# EAGLE design MTRduino_rev5.0 (EAGLE 7.2.0)
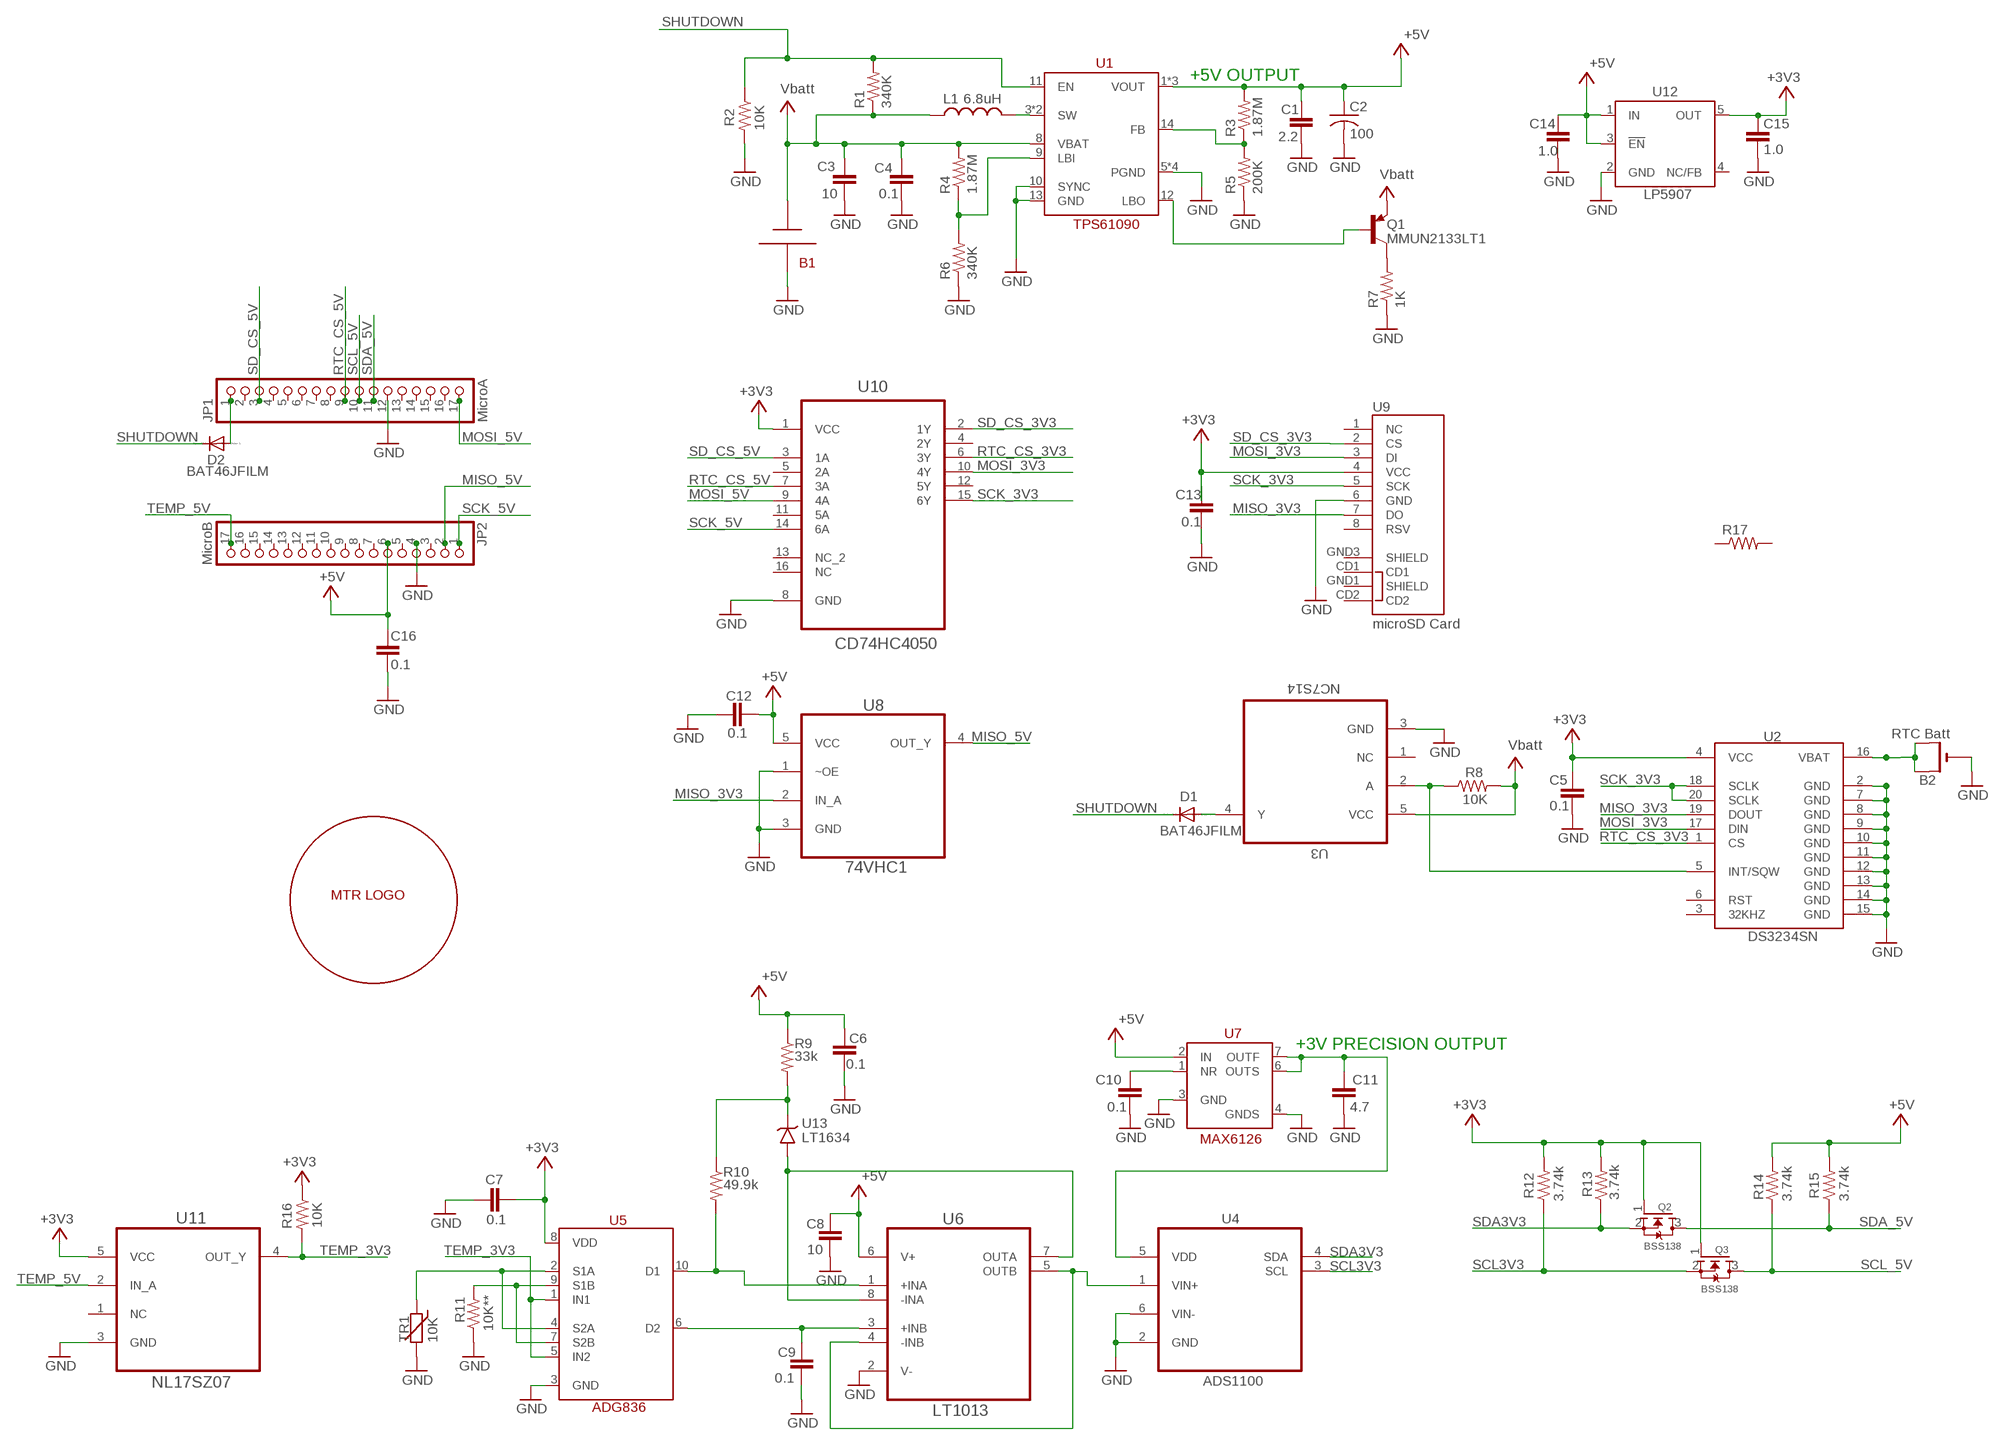
[diagram p0: schematic, sheet 1]

## Parts
B1  2x AA BATT  BATT_AA2  [BATT_AA2]
B2  RTC Batt  CR1220SMT  [CR1220-SMD]
C1  2.2  C-EUC0603  [C0603]
C2  100  C-USC1206K  [C1206K]
C3  10  C-EUC0603  [C0603]
C4  0.1  C-EUC0603  [C0603]
C5  0.1  C-EUC0603  [C0603]
C6  0.1  C-EUC0603  [C0603]
C7  0.1  C-EUC0603  [C0603]
C8  10  C-EUC0603  [C0603]
C9  0.1  C-EUC0603  [C0603]
C10  0.1  C-EUC0603  [C0603]
C11  4.7  C-EUC0603  [C0603]
C12  0.1  C-EUC0603  [C0603]
C13  0.1  C-EUC0603  [C0603]
C14  1.0  C-EUC0603  [C0603]
C15  1.0  C-EUC0603  [C0603]
C16  0.1  C-EUC0603  [C0603]
D1  BAT46JFILM  DIODE-SOD323-R  [SOD323-R]
D2  BAT46JFILM  DIODE-SOD323-R  [SOD323-R]
JP1  MicroA  PINHD-1X17  [1X17]
JP2  MicroB  PINHD-1X17  [1X17]
L1  6.8uH  L-USVLC6045  [VLC6045]
Q1  MMUN2133LT1  MMUN2111LT1  [SC59-BEC]
Q2  BSS138  MOSFET-NREFLOW  [SOT23]
Q3  BSS138  MOSFET-NREFLOW  [SOT23]
R1  340K  R-US_R0603  [R0603]
R2  10K  R-US_R0603  [R0603]
R3  1.87M  R-US_R0805  [R0805]
R4  1.87M  R-US_R0805  [R0805]
R5  200K  R-US_R0603  [R0603]
R6  340K  R-US_R0603  [R0603]
R7  1K  R-US_R0603  [R0603]
R8  10K  R-US_R0603  [R0603]
R9  33k  R-US_R0603  [R0603]
R10  49.9k  R-US_R0603  [R0603]
R11  10K**  R-US_R1206  [R1206]
R12  3.74k  R-US_R0603  [R0603]
R13  3.74k  R-US_R0603  [R0603]
R14  3.74k  R-US_R0603  [R0603]
R15  3.74k  R-US_R0603  [R0603]
R16  10K  R-US_R0603  [R0603]
R17  R-US_R0805  [R0805]
TR1  10K  THERMISTOR_R-5  [R-5]
U1  TPS61090  TPS61090RSAR  [QFN16-4X4]
U2  DS3234SN  DS3234  [DS3234]
U3  NC7S14  1P1G14MDBVREPG4  [SOT95P280X145-5N]
U4  ADS1100  ADS1100A0IDBVT  [SOT95P280X145-6N]
U5  ADG836  [MSOP10]
U6  LT1013  LT1013DS8PBF  [SOIC127P600X175-8N]
U7  MAX6126  [SOIC127P600X175-8N]
U8  74VHC1  M74VHC1GT125DF1G  [SOT65P210X110-5N]
U9  microSD Card  USD-SOCKET  [MICROSD_1:1]
U10  CD74HC4050  M74HC4050RM13TR  [SOIC127P600X175-16N]
U11  NL17SZ07  NL17SZ07DFT2G  [SOT65P210X110-5N]
U12  LP5907  TPS77030  [SOT23-DBV]
U13  LT1634  LT1634BIS8-1.25  [S8]
U$1  MTRLOGO  [MTRLOGO]

## Nets
+3V3: C5.1 C7.2 C13.1 C15.1 Q2.1(G) Q3.1(G) R12.2 R13.2 R16.1 U2.4(VCC) U5.8(VDD) U9.4(VCC) U10.1(VCC) U11.5(VCC) U12.5(OUT)
+5V: C1.1 C2.1 C6.2 C8.2 C12.1 C14.1 C16.1 JP2.6 R3.2 R9.1 R14.2 R15.2 U1.1(VOUT) U1.15(VOUT) U1.16(VOUT) U6.6(V+) U7.2(IN) U8.5(VCC) U12.1(IN) U12.3(!EN)
GND: B1.-(+) B2.- C1.2 C2.2 C3.2 C4.2 C5.2 C6.1 C7.1 C8.1 C9.1 C10.2 C11.2 C12.2 C13.2 C14.2 C15.2 C16.2 JP1.12 JP2.4 R2.2 R5.1 R6.1 R7.1 R11.1 TR1.2 U1.5(PGND) U1.6(PGND) U1.7(PGND) U1.10(SYNC) U1.13(GND) U1.EXP(PGND) U2.2(GND) U2.7(GND) U2.8(GND) U2.9(GND) U2.10(GND) U2.11(GND) U2.12(GND) U2.13(GND) U2.14(GND) U2.15(GND) U3.3(GND) U4.2(GND) U4.6(VIN-) U5.3(GND) U6.2(V-) U7.3(GND) U7.4(GNDS) U8.1(~OE) U8.3(GND) U9.6(GND) U10.8(GND) U11.3(GND) U12.2(GND)
MISO_3V3: U2.19(DOUT) U8.2(IN_A) U9.7(DO)
MISO_5V: JP2.2 U8.4(OUT_Y)
MOSI_3V3: U2.17(DIN) U9.3(DI) U10.10(4Y)
MOSI_5V: JP1.17 U10.9(4A)
N$1: D1.A U3.4(Y)
N$2: C9.2 U5.6(D2) U6.3(+INB)
N$4: C10.1 U7.1(NR)
N$5: U4.1(VIN+) U6.4(-INB) U6.5(OUTB)
N$6: B2.+$1(+) B2.+$2(+1) U2.16(VBAT)
N$7: L1.P$3 U1.3(SW) U1.4(SW)
N$8: R9.2 R10.1 U13.6(VOUT)
N$9: TR1.1 U5.2(S1A) U5.4(S2A)
N$10: R11.2 U5.7(S2B) U5.9(S1B)
N$11: R4.1 R6.2 U1.9(LBI)
N$12: Q1.C R7.2
N$13: R3.1 R5.2 U1.14(FB)
N$14: U6.7(OUTA) U6.8(-INA) U13.4(GND)
N$16: R10.2 U5.10(D1) U6.1(+INA)
N$17: R8.1 U2.5(INT/SQW) U3.2(A)
N$19: Q1.B U1.12(LBO)
N$21: D2.A JP1.1
N$38: C11.1 U4.5(VDD) U7.6(OUTS) U7.7(OUTF)
RTC_CS_3V3: U2.1(CS) U10.6(3Y)
RTC_CS_5V: JP1.9 U10.7(3A)
SCK_3V3: U2.18(SCLK) U2.20(SCLK) U9.5(SCK) U10.15(6Y)
SCK_5V: JP2.1 U10.14(6A)
SCL3V3: Q3.2(S) R12.1 U4.3(SCL)
SCL_5V: JP1.10 Q3.3(D) R14.1
SD_CS_3V3: U9.2(CS) U10.2(1Y)
SD_CS_5V: JP1.3 U10.3(1A)
SDA3V3: Q2.2(S) R13.1 U4.4(SDA)
SDA_5V: JP1.11 Q2.3(D) R15.1
SHUTDOWN: D1.C D2.C R1.2 R2.1 U1.11(EN)
TEMP_3V3: R16.2 U5.1(IN1) U5.5(IN2) U11.4(OUT_Y)
TEMP_5V: JP2.17 U11.2(IN_A)
V+: B1.+(-) C3.1 C4.1 L1.P$2 Q1.E R1.1 R4.2 R8.2 U1.8(VBAT) U3.5(VCC) ; supply symbol labelled Vbatt
Unconnected: JP1.2 JP1.4 JP1.5 JP1.6 JP1.7 JP1.8 JP1.13 JP1.14 JP1.15 JP1.16 JP2.3 JP2.5 JP2.7 JP2.8 JP2.9 JP2.10 JP2.11 JP2.12 JP2.13 JP2.14 JP2.15 JP2.16 R17.1 R17.2 U2.3(32KHZ) U2.6(RST) U3.1(NC) U9.1(NC) U9.8(RSV) U9.CD1 U9.CD2 U9.GND1(SHIELD) U9.GND3(SHIELD) U10.4(2Y) U10.5(2A) U10.11(5A) U10.12(5Y) U10.13(NC_2) U10.16(NC) U11.1(NC) U12.4(NC/FB)

## Notes on the sheet
- +5V OUTPUT
- +3V PRECISION OUTPUT

## Library data of the parts
B1 = adafruit:BATT_AA2
B2 = adafruit:CR1220: CR1216/CR1220/CR1225 12mm 3V lithium coin cell Great for battery packup. Both SMT and THM holders. Note the THM package has the ground pads on both sides of the PCB so that the masks are the same - this reduces the cost
C1 C3-C16 = rcl:C-EU: CAPACITOR, European symbol
C2 = resistor:C-US: CAPACITOR, American symbol
D1 D2 = diode:DIODE-: DIODE
JP1 JP2 = pinhead:PINHD-1X17: PIN HEADER
L1 = resistor:L-US: INDUCTOR, American symbol
Q1 = transistor-pnp:MMUN2111*: PNP Transistror
Q2 Q3 = adafruit:MOSFET-N: N-Channel Mosfet 2N7002E - 60V 260mA SOT23 [Digikey: 2N7002ET1GOSTR-ND] - REEL BSH103 - 30V 850mA SOT23 [Digikey: 568-5013-1-ND]
R1-R10 R12-R17 = resistor:R-US_: RESISTOR, American symbol
R11 = rcl:R-US_: RESISTOR, American symbol
TR1 = discrete:THERMISTOR_: Thermo Resistor
U1 = microchip:TPS61090RSAR
U2 = SparkFun-FreqCtrl:DS3234: SPI RTC module with battery backup and internal clock.
U3 = Texas Instruments_By_element14_Batch_1:1P1G14MDBVREPG4: SINGLE SCHMITT-TRIGGER INVERTER; MPN: 1P1G14MDBVREPG4; OC_FARNELL: -; OC_NEWARK: 56P2415; PACKAGE: SOT-23-5; SUPPLIER: Texas Instruments
U4 = Texas Instruments_By_element14_Batch_1:ADS1100A0IDBVT: Self-Calibrating, 16-Bit ANALOG-TO-DIGITAL CONVERTER; MPN: ADS1100A0IDBVT; OC_FARNELL: 1135959; OC_NEWARK: 20H0708; PACKAGE: SOT-23-6; SUPPLIER: Texas Instruments
U5 = analog-devices:ADG836
U6 = LTC_By_element14_Batch_1:LT1013DS8PBF: Dual Precision Op Amp; MPN: LT1013DS8#PBF; OC_FARNELL: 9559302; OC_NEWARK: 57M0827; PACKAGE: SOIC-8; SUPPLIER: LINEAR TECHNOLOGY
U7 = Maxim_By_element14_Batch_1:MAX6126
U8 = ON Semiconductor_By_element14_Batch_1:M74VHC1GT125DF1G: Noninverting Buffer / CMOS Logic Level Shifter; MPN: M74VHC1GT125DF1G; OC_FARNELL: 1567363; OC_NEWARK: 83H7591; PACKAGE: SOT-23-5; SUPPLIER: ON SEMICONDUCTOR
U9 = SparkFun-Connectors:USD-SOCKET: microSD Socket Push-push type uSD socket. Schematic element and footprint production proven. Spark Fun Electronics SKU : PRT-00127. tDoc lines correctly indicate media card edge positions when inserting (unlocked, locked, depressed). NOTE: CD1 and CD2 are connected internally; PROD_ID: CONN-07820
U10 = ST Microelctronics_By_element14_Batch_1:M74HC4050RM13TR: HEX BUFFER/CONVERTER; MPN: M74HC4050RM13TR; OC_FARNELL: 1261257; OC_NEWARK: 89K0905; PACKAGE: SOIC-16; SUPPLIER: STMICROELECTRONICS
U11 = ON Semiconductor_By_element14_Batch_1:NL17SZ07DFT2G: Single Non-Inverting Buffer with Open Drain Output; MPN: NL17SZ07DFT2G; OC_FARNELL: 1705431; OC_NEWARK: 04R7799; PACKAGE: SOT-353-5; SUPPLIER: ON Semiconductor
U12 = texas:TPS770*: ULTRALOW-POWER 50-mA LOW-DROPOUT LINEAR REGULATORS 50-mA Low-Dropout Regulator Source: http://focus.ti.com/lit/ds/symlink/tps77001.pdf; MF: TEXAS INSTRUMENTS; MPN: TPS77030DBVT; OC_FARNELL: 1207348; OC_NEWARK: 77C1185
U13 = linear-technology:LT1634: Micropower Precision Shunt Voltage Reference Source: Darta sheet <http://cds.linear.com/docs/en/datasheet/1634fe.pdf>
U$1 = SparkFun-Passives:MTRLOGO

## Board
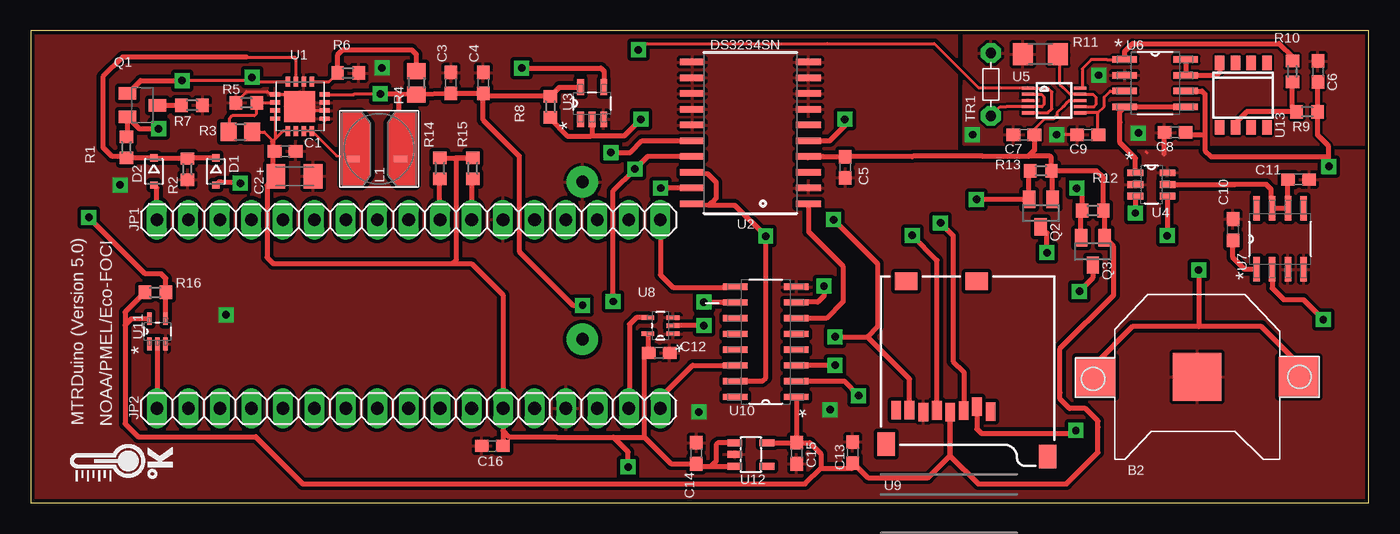
[diagram p1: board, top side]
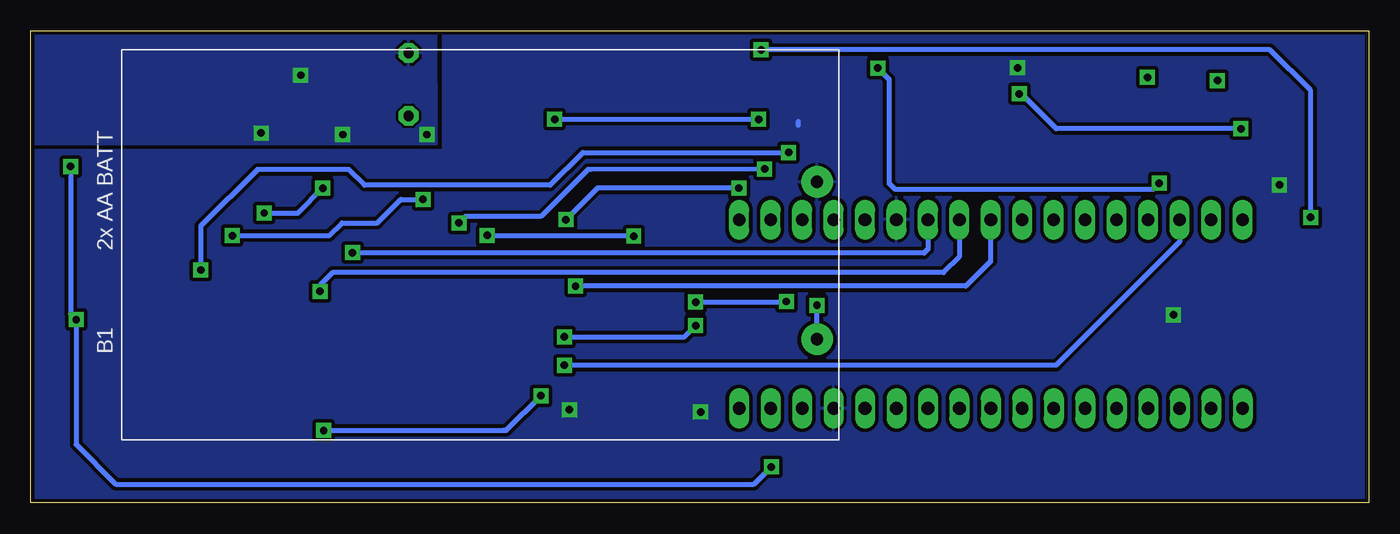
[diagram p2: board, bottom side, seen from below]

Size 107.95 x 38.1 mm. Coordinates in mm from the lower left corner, seen from the top.
Outline: 0,0 107.95,0 107.95,38.1 0,38.1 0,0
Copper layers (1*16): Top 0.035mm / dielectric 1.5mm / Bottom 0.035mm
Design rules "default *": minimum track width 8mil, minimum drill 20mil, track to track 8mil, track to pad 8mil, pad to pad 8mil, via to via 10mil, smd to smd 8mil, copper to edge 12mil, drill to drill 12mil, minimum pad ring 12mil, minimum via ring 12mil, stop-mask expansion 4mil, vias tented up to drill 0mil, thermal gap 10mil

### Footprints (pad centres in the part's own frame; a part is rotated, then mirrored left to right if it is on the bottom)
BATT_AA2 = drill 1 pad 2.54: + -27.178,7.62; - -27.178,-5.08
CR1220-SMD = smd 3.2 x 3.2: +$1 -8.2,0; +$2 8.2,0 | smd 3.9 x 3.9: - 0,0
C0603 = smd 1.1 x 1: 1 -0.85,0; 2 0.85,0
C1206K = smd 1.5 x 2: 1 -1.5,0; 2 1.5,0
SOD323-R = smd 0.6 x 0.6: A 1.1,0; C -1.1,0
1X17 = drill 1.016 long: 1 -20.32,0; 2 -17.78,0; 3 -15.24,0; 4 -12.7,0; 5 -10.16,0; 6 -7.62,0; 7 -5.08,0; 8 -2.54,0; 9 0,0; 10 2.54,0; 11 5.08,0; 12 7.62,0; 13 10.16,0; 14 12.7,0; 15 15.24,0; 16 17.78,0; 17 20.32,0
VLC6045 = smd 1.016 x 0.508: P$2 1.27,3.81; P$3 5.08,3.81
SC59-BEC = smd 1 x 1.4: B -0.95,-1.2; C 0,1.2; E 0.95,-1.2
SOT23 = smd 1 x 1.4: 1 -0.95,-1.1; 2 0.95,-1.1; 3 0,1.1
R0603 = smd 1 x 1.1: 1 -0.85,0; 2 0.85,0
R0805 = smd 1.3 x 1.5: 1 -0.95,0; 2 0.95,0
R1206 = smd 1.6 x 1.803: 1 -1.422,0; 2 1.422,0
R-5 = drill 0.813 pad 1.6 octagon: 1 -2.54,0; 2 2.54,0
QFN16-4X4 = smd 0.8 x 0.35: 1 -2,0.975; 2 -2,0.325; 3 -2,-0.325; 4 -2,-0.975; 9 2,-0.975; 10 2,-0.325; 11 2,0.325; 12 2,0.975 | smd 0.35 x 0.8: 5 -0.975,-2; 6 -0.325,-2; 7 0.325,-2; 8 0.975,-2; 13 0.975,2; 14 0.325,2; 15 -0.325,2; 16 -0.975,2 | smd 2.5 x 2.5: EXP 0,0
DS3234 = smd 0.53 x 1.98: 1 -5.715,-4.685; 2 -4.445,-4.685; 3 -3.175,-4.685; 4 -1.905,-4.685; 5 -0.635,-4.685; 6 0.635,-4.685; 7 1.905,-4.685; 8 3.175,-4.685; 9 4.445,-4.685; 10 5.715,-4.685; 11 5.715,4.685; 12 4.445,4.685; 13 3.175,4.685; 14 1.905,4.685; 15 0.635,4.685; 16 -0.635,4.685; 17 -1.905,4.685; 18 -3.175,4.685; 19 -4.445,4.685; 20 -5.715,4.685
SOT95P280X145-5N = smd 1.27 x 0.559: 1 -1.295,0.94; 2 -1.295,0; 3 -1.295,-0.94; 4 1.295,-0.94; 5 1.295,0.94
SOT95P280X145-6N = smd 1.27 x 0.559: 1 -1.295,0.94; 2 -1.295,0; 3 -1.295,-0.94; 4 1.295,-0.94; 5 1.295,0; 6 1.295,0.94
MSOP10 = smd 0.25 x 1: 1 -1,-2.113; 2 -0.5,-2.113; 3 0,-2.113; 4 0.5,-2.113; 5 1,-2.113; 6 1,2.113; 7 0.5,2.113; 8 0,2.113; 9 -0.5,2.113; 10 -1,2.113
SOIC127P600X175-8N = smd 1.981 x 0.533: 1 -2.464,1.905; 2 -2.464,0.635; 3 -2.464,-0.635; 4 -2.464,-1.905; 5 2.464,-1.905; 6 2.464,-0.635; 7 2.464,0.635; 8 2.464,1.905
SOT65P210X110-5N = smd 1.016 x 0.356: 1 -1.016,0.66; 2 -1.016,0; 3 -1.016,-0.66; 4 1.016,-0.66; 5 1.016,0.66
MICROSD_1:1 = smd 0.8 x 1.5: 1 5.096,10.919; 2 6.218,10.519; 3 7.274,10.853; 4 8.367,10.982; 5 9.421,10.828; 6 10.539,10.973; 7 11.648,10.819; 8 12.721,10.819 | smd 1.8 x 1.4: CD1 11.92,0.4; CD2 6.22,0.4 | smd 1.4 x 1.9: GND1 0.497,14.55; GND3 13.52,13.55
SOIC127P600X175-16N = smd 1.981 x 0.508: 1 -2.464,4.445; 2 -2.464,3.175; 3 -2.464,1.905; 4 -2.464,0.635; 5 -2.464,-0.635; 6 -2.464,-1.905; 7 -2.464,-3.175; 8 -2.464,-4.445; 9 2.464,-4.445; 10 2.464,-3.175; 11 2.464,-1.905; 12 2.464,-0.635; 13 2.464,0.635; 14 2.464,1.905; 15 2.464,3.175; 16 2.464,4.445
SOT23-DBV = smd 0.55 x 1.2: 1 -0.95,-1.3; 2 0,-1.3; 3 0.95,-1.3; 4 0.95,1.3; 5 -0.95,1.3
S8 = smd 0.762 x 1.143: 1 -1.905,-2.6; 2 -0.635,-2.6; 3 0.635,-2.6; 4 1.905,-2.6; 5 1.905,2.6; 6 0.635,2.6; 7 -0.635,2.6; 8 -1.905,2.6

### Placement (x,y rotation side)
B1  71.69,20.83 180 bottom
B2  94.13,10.16 180 top
C1  20.52,28.39 0 top
C2  21.27,26.36 0 top
C3  33.9,33.9 90 top
C4  36.5,33.9 90 top
C5  65.72,27.09 270 top
C6  103.86,34.82 270 top
C7  80.14,29.72 0 top
C8  92.33,29.9 0 top
C9  85.29,29.72 0 top
C10  97,22.06 90 top
C11  102.3,26.1 0 top
C12  50.7,12.1 0 top
C13  66.32,4.05 90 top
C14  53.7,4 90 top
C15  61.8,4 270 top
C16  37.24,4.6 180 top
D1  14.93,26.75 270 top
D2  9.92,26.75 270 top
JP1  30.48,22.86 0 top
JP2  30.48,7.62 180 top
L1  31.1,31.57 180 top
Q1  9,32.1 270 top
Q2  81.5,23.4 180 top
Q3  85.7,20.3 180 top
R1  7.7,28.7 270 top
R2  12.63,26.94 270 top
R3  16.89,29.95 0 top
R4  31.1,33.9 270 top
R5  17.4,32.3 0 top
R6  25.6,34.7 180 top
R7  13,32.1 180 top
R8  41.92,31.98 90 top
R9  103,31.57 180 top
R10  101.8,34.82 90 top
R11  81.47,36.23 0 top
R12  85.7,23.6 0 top
R13  81.5,26.8 0 top
R14  32.99,27 90 top
R15  35.65,27 90 top
R16  10.03,16.99 0 top
R17  0,-5.59 0 top  (outside the outline)
TR1  77.47,33.78 90 top
U1  21.7,32 90 top
U2  58.06,29.87 90 top
U3  45.29,32.26 90 top
U4  90.43,25.7 0 top
U5  82.58,32.49 270 top
U6  90.73,33.88 0 top
U7  100.81,21.3 90 top
U8  50.8,14.3 180 top
U9  82.55,18.29 180 top
U10  59.3,13 180 top
U11  10.21,13.84 90 top
U12  58.1,3.9 270 top
U13  97.84,32.92 180 top
U$1  11.68,1.52 90 top

### Tracks (layer width: path | path; a pad name or v marks a point on that pad's centre or on a via)
+3V3
  Top 0.254: R13.2 82.35,24.65 82.5,24.5 | U5.8 83.8,32.49 83.57,32.26 83.31,32 82.8,31.5 82.8,31.24 82.55,30.99 81.79,30.99 80.99,30.19 C7.2
  Top 0.406: U10.1 61.8,8.52 C15.1 | 62.68,27.87 U2.4 | U12.5 C15.1 | C15.1 62.85,4.85 63.75,3.95 63.75,2.79 | 62.67,27.86 U2.4 | Q2.1 82.45,26.7 R13.2 | R13.2 86,26.8 86.55,26.25 R12.2 86.65,23.5 Q3.1 87.38,20.67 87.38,16.76 83.06,12.45 83.06,8.89 83.06,8.38 83.82,7.62 85.09,7.62 86.11,6.6 86.11,6.1 86.11,4.06 83.57,1.52 76.45,1.52 74.17,3.81 | U11.5 8.1,14.86 7.59,14.35 | 7.59,14.35 7.59,6.38 8.64,5.33 18.14,5.33 21.95,1.52 62.48,1.52 63.75,2.79 | 62.68,27.87 U2.4 | R13.2 82.35,27.89 82.25,27.99 80.52,27.99 | R16.1 7.59,15.4 7.59,14.35 | U2.4 63.91,27.96 65.69,27.96 C5.1 71.12,27.94 71.17,27.99 76.81,27.99 80.52,27.99 | C7.2 80.99,28.46 80.52,27.99 | 63.75,2.79 66.32,2.79 C13.1 66.39,3.2 67.56,2.03 72.39,2.03 74.17,3.81 | 74.17,3.81 74.17,7.29 | 74.17,7.29 U9.4 74.17,7.29 | 74.17,7.29 74.17,3.81
+5V  (via drill 0.6)
  Top 0.254: 20.35,30 U1.1 20.35,30 | 20.35,30 20.3,30 19.7,29.4 | U1.15 U1.16 19.7,29.4 | 19.7,29.4 19.5,29.2 | 20.35,30 19.56,29.21 | 19.56,29.21 19.56,26.42 | R3.2 18.82,29.95 19.56,29.21
  Top 0.406: 19.5,29.2 19.5,28.05 | 54.9,2.95 53.9,2.95 C14.1 51.65,3.15 49.5,5.3 | 54.9,2.95 U12.3 | 49.5,5.3 49.5,11.85 49.6,11.85 C12.1 49.85,13.57 U8.5 | 47,5.3 49.5,5.3 | U12.1 55.45,4.85 55.3,4.7 55.3,3.35 54.9,2.95 | C1.1 19.5,28.05 | U7.2 100.17,17.32 101.1,16.4 102.7,16.4 v104.3,14.8 | v48.2,2.9 48.2,4.1 47,5.3 | 104.7,27.94 104.7,28.85 104.19,29.36 103.85,29.71 R9.1 103.86,31.59 C6.2 | 104.7,27.94 104.7,27.76 104.7,27.2 v104.75,27.15 | 47,5.3 42.4,5.3 38.64,5.3 38.1,5.84 | 19.5,28.05 19.5,26.47 C2.1 | R14.2 34.29,27.85 R15.2 34.3,27.85 34.29,27.84 34.29,19.56 34.04,19.3 | 19.56,26.42 19.05,25.65 19.05,19.81 19.56,19.3 34.04,19.3 | U6.6 94.51,33.25 94.74,33.02 94.74,29.72 | 94.74,29.72 94.74,28.45 95.25,27.94 104.37,27.94 104.7,27.94 | C8.2 93.36,29.72 94.74,29.72 | 34.04,19.3 35.56,19.3 38.1,16.76 JP2.6 38.1,5.84 | 38.1,5.84 C16.1
  Bottom 0.406: v48.2,2.9 49.6,1.5 101.1,1.5 104.3,4.7 v104.3,14.8 104.75,15.25 v104.75,27.15
GND  (via drill 0.6)
  Top 0.254: U1.6 22.02,31.68 U1.EXP 20.73,32.98 U1.13 19.32,32.98 19.1,33.2 17.4,33.2 16.5,32.3 16.4,32.4 16.45,32.4 R5.1 | 89.99,28.35 90.07,28.27 | C9.1 83.31,29.72
  Top 0.406: U1.5 23.7,30.9 | C8.1 91.44,29.86 91.44,28.19
  Bottom 0.406: 46.04,30.8 46.04,30.48
  other vias: 15.74,15.18 7.18,25.66 28.33,35.13 53.9,7.33 64.49,7.51 89.38,29.86 82.78,29.73 76,29.73 86.18,34.53
  pour Top (isolate 0.305): -1.96,39.55 74.7,39.29 74.7,28.45 108.43,28.45 108.43,-0.36 -1.93,-0.36 -1.93,39.42
  pour Top: 75.26,28.96 108.74,28.96 108.76,38.73 75.29,38.51
  pour Bottom: 75.26,28.96 108.74,28.96 108.76,38.73 75.29,38.76
  pour Bottom (isolate 0.305): -1.96,39.55 74.7,39.55 74.7,28.45 108.43,28.45 108.43,-0.36 -1.93,-0.36 -1.93,39.42
MISO_3V3  (via drill 0.6)
  Top 0.406: v64.9,13.4 67.5,13.4 | v54.3,14.3 U8.2 | U2.19 v50.83,25.41 50.8,25.41 | v64.77,22.86 68.33,19.3 68.33,14.22 67.5,13.4 | U9.7 70.9,10 67.5,13.4
  Bottom 0.406: v64.9,13.4 55.2,13.4 v54.3,14.3 | v50.83,25.41 62.22,25.41 v64.77,22.86
MISO_5V
  Top 0.406: U8.4 48.86,14.96 48.3,14.4 48.3,7.66 JP2.2
MOSI_3V3  (via drill 0.6)
  Top 0.406: U10.10 54.33,16.18 v54.3,16.2 | U2.17 49.76,27.96 v48.74,26.95 46.99,25.2 v46.99,16.26 | v73.41,22.61 74.42,21.59 74.42,11.43 75.28,10.58 U9.3
  Bottom 0.406: v48.74,26.95 62.74,26.92 62.99,26.92 66.8,23.11 72.9,23.11 v73.41,22.61 | v54.3,16.2 47.05,16.2 v46.99,16.26
MOSI_5V
  Top 0.406: JP1.17 50.8,18.4 51.8,17.4 56.79,17.4 U10.9
N$1  (via drill 0.6)
  Top 0.406: U3.4 46.25,33.58 46.25,34.85 46,35.1 v39.6,35.1 | v16.9,25.8 16.8,25.9 15.34,25.9 15.18,25.9 D1.A
  Bottom 0.406: v16.9,25.8 17.4,25.3 38.2,25.3 38.7,25.8 38.7,34.2 v39.6,35.1
N$2
  Top 0.254: 86.11,31.5 85.09,31.5 | 85.09,31.5 U5.6 | 86.11,31.5 86.61,32 86.61,32.77 87.1,33.25 U6.3 | C9.2 86.11,29.75 86.11,31.5 | U5.6 85.09,31.5 | 85.09,31.5 U5.6 | U5.6
N$4
  Top 0.406: U7.1 97.96,18.84 97,19.8 97,20.65 C10.1
N$5
  Top 0.406: U6.5 U6.4 87.88,31.6 87.88,30.73 87.88,29.08 89.14,27.83 U4.1
N$6  (via drill 0.6)
  Top 0.406: v46.8,28.3 48.39,28.3 49.33,29.23 U2.16 | B2.+$1 102.33,11.21 99.31,14.22 94.23,14.22 | 94.23,14.22 88.9,14.22 85.85,11.18 85.85,10.24 B2.+$2 | v94.23,18.8 94.23,14.22
  Bottom 0.406: v46.8,28.3 63.4,28.3 66.04,25.65 81.03,25.65 82.3,26.92 89.66,26.92 94.23,22.35 v94.23,18.8
N$7
  Top 0.254: U1.3 U1.4 24.66,28.02 L1.P$3
N$8
  Top 0.406: R10.1 101.8,31.92 101.88,31.84 R9.2 102.13,31.59 98.13,31.59 97.21,30.66 U13.6
N$9
  Top 0.254: U5.2 81.53,32.99 | 81.53,32.99 81.53,32.97 | 81.53,32.99 81.74,32.78 81.74,32.13 81.59,31.99 U5.4 78.72,31.99 78.22,31.99 TR1.1
N$10
  Top 0.254: U5.7 85.78,31.99 85.98,32.18 85.98,32.72 85.71,32.99 U5.9 83.85,32.99 83.57,33.27 83.31,33.53 83.06,33.78 83.06,36.06 R11.2 83.57,36.14
N$11
  Top 0.254: U1.9 24.05,34 R6.2
  Top 0.406: R6.2 24.75,36.18 25.15,36.58 30.73,36.58 31.1,36.21 R4.1
N$12
  Top 0.406: Q1.C R7.2
N$13
  Top 0.254: U1.14 19.68,32.3 R5.2 18.2,32.25 18.2,31.41 18.03,31.24 16.26,31.24 16,30.99 16,30.26 R3.1
N$14
  Top 0.406: U6.8 U6.7 95.7,34.52 95.94,34.76 U13.4
N$16
  Top 0.254: U6.1 86.84,35.79 85.57,35.79 84.84,35.05 84.84,33.63 U5.10
  Top 0.406: U6.1 88.27,36.45 88.9,37.08 100.72,37.08 101.88,35.93 R10.2
N$17  (via drill 0.6)
  Top 0.406: 45.21,29.62 43.28,29.62 41.92,30.98 R8.1 | U3.2 45.29,29.69 45.21,29.62 | v49.23,30.96 47.88,29.62 45.21,29.62 | U2.5 64.47,29.23 65.68,30.45 v65.68,30.96
  Bottom 0.406: v65.68,30.96 v49.23,30.96
N$19  (via drill 0.6)
  Top 0.254: U1.12 18.2,34 v17.85,34.35 17.59,34.1 v12.2,34.1
  Top 0.406: Q1.B 8.85,34.1 v12.2,34.1
N$21
  Top 0.406: JP1.1 10.16,25.42 D2.A
N$38
  Top 0.254: U7.7 U7.6
  Top 0.406: 101.5,24 101.5,23.8 100.21,23.8 U7.7 100.1,23.84 100.1,25.3 99.7,25.7 97.18,25.7 | U7.6 C11.1 | 97.18,25.7 96.59,25.7 | U4.5 97.18,25.7
RTC_CS_3V3
  Top 0.406: U10.6 64.2,14.9 65.54,16.24 65.53,16.25 65.53,19.1 62.75,21.88 U2.1
RTC_CS_5V  (via drill 0.6)
  Top 0.406: v64,17.5 64,16.7 63.5,16.2 61.79,16.2 U10.7
  Bottom 0.406: v64,17.5 32.5,17.5 30.48,19.52 JP1.9
SCK_3V3  (via drill 0.6)
  Top 0.406: 54.71,24.03 54.94,24.26 54.97,24.26 55.3,24.59 55.3,25.88 54.61,26.57 U2.18 | U10.15 59.02,9.82 59.3,10.1 v59.3,21.52 56.79,24.03 54.71,24.03 | U2.20 54.71,24.03 | U9.5 73.13,19.58 v71.12,21.59
  Bottom 0.406: 59.32,21.5 v59.3,21.52 59.37,21.59 v71.12,21.59
SCK_5V
  Top 0.406: U10.14 53.4,11.1 50.8,8.5 JP2.1
SCL3V3  (via drill 0.6)
  Top 0.406: Q3.2 84.75,23.5 R12.1 84.85,24.95 v84.4,25.4 | U4.3 v89.14,23.4 v89.13,23.39
  Bottom 0.406: v89.13,23.39 86.41,23.39 v84.4,25.4
SCL_5V  (via drill 0.6)
  Top 0.406: 33.02,22.3 JP1.10 32.99,22.89 R14.1 | Q3.3 85.7,18.16 v84.62,17.08
  Bottom 0.406: JP1.10 33.02,19.86 34.29,18.59 83.59,18.59 84.62,17.57 v84.62,17.08
SD_CS_3V3  (via drill 0.6)
  Top 0.406: U9.2 76.33,5.96 76.45,5.84 76.71,5.59 84.07,5.59 v84.33,5.84 | U10.2 65.61,9.82 v66.8,8.64
  Bottom 0.406: v84.33,5.84 69.85,5.84 | 69.85,5.84 69.69,5.84 | v66.8,8.64 69.6,5.84 69.85,5.84
SD_CS_5V  (via drill 0.6)
  Top 0.406: v64.9,11.1 v64.89,11.1 U10.3
  Bottom 0.406: 30.7,11.1 31.24,11.1 | 31.24,11.1 v64.9,11.1 | JP1.3 15.24,21.08 25.15,11.18 25.22,11.1 31.24,11.1
SDA3V3  (via drill 0.6)
  Top 0.406: R13.1 80.55,26.7 Q2.2 80.3,24.75 80.04,24.5 v76.32,24.5 | U4.4 91.73,21.6 v91.69,21.57
  Bottom 0.406: v91.69,21.57 83.9,21.57 82.86,22.61 80.01,22.61 80,22.6 78.1,24.5 v76.32,24.5
SDA_5V  (via drill 0.6)
  Top 0.406: JP1.11 35.6,22.9 35.6,26.15 R15.1 | v82,20.2 82,21.8 Q2.3
  Bottom 0.406: JP1.11 35.56,20.47 35.87,20.17 81.97,20.17 v82,20.2
SHUTDOWN
  Top 0.254: 17.4,36 21.3,36 21.38,35.92 U1.11
  Top 0.406: 17.4,36 7.4,36 5.8,34.4 5.8,28.7 6.5,28 7.55,28 R1.2 D2.C 9.98,27.79 R2.1 12.69,27.85 D1.C
TEMP_3V3  (via drill 0.6)
  Top 0.254: U5.5 82.08,31.49 82.4,31.8 82.4,33.17 82.08,33.49 U5.1 | v49.02,36.58 49.53,37.08 64.26,37.08 72.9,37.08 76.45,33.53 80.42,33.53 | 80.42,33.53 U5.1 | 80.42,33.53 U5.1
  Top 0.406: U11.4 10.88,14.87 R16.2 10.88,18.12 10.52,18.49 9.22,18.49 v4.67,23.04
  Bottom 0.406: v4.67,23.04 4.67,33.3 7.95,36.58 v49.02,36.58
TEMP_5V
  Top 0.406: U11.2 10.21,7.67 JP2.17
V+  (via drill 0.6)
  Top 0.254: U1.8 26.07,32.98 26.12,33.02 v28.19,33.02
  Top 0.406: R1.1 7.8,29.65 Q1.E 8.75,30.2 v10.3,30.2 | C4.1 36.5,30.9 39.4,28 39.4,20.3 43.75,15.95 v44.51,15.95 | C4.1 C3.1 R4.2 29.72,33.05 | L1.P$2 29.72,28.13 29.72,33.05 | v28.19,33.02 28.22,33.05 29.72,33.05 | C4.1 36.72,32.83 R8.2 42.65,33.55 U3.5
  Bottom 0.406: v10.3,30.2 25.2,30.2 28.02,33.02 v28.19,33.02 | B1.+ v44.51,15.95

### Text on the board
tNames: + | MTRDuino (Version 5.0) | NOAA/PMEL/Eco-FOCI
tValues: 12 | 11 | 10 | 9 | 8 | 7 | 6 | 5 | 4 | 3 | 2 | RS | RX | TX | SS | GND | MOSI | 13 | 3V | AREF | A0 | A1 | A2 | A3 | A4 | A5 | NC | NC | +5V | RS | VIN | MISO | SCK | GND